# EAGLE design TIVA_SHIELD_Ver_2.2 (EAGLE 9.6.2)
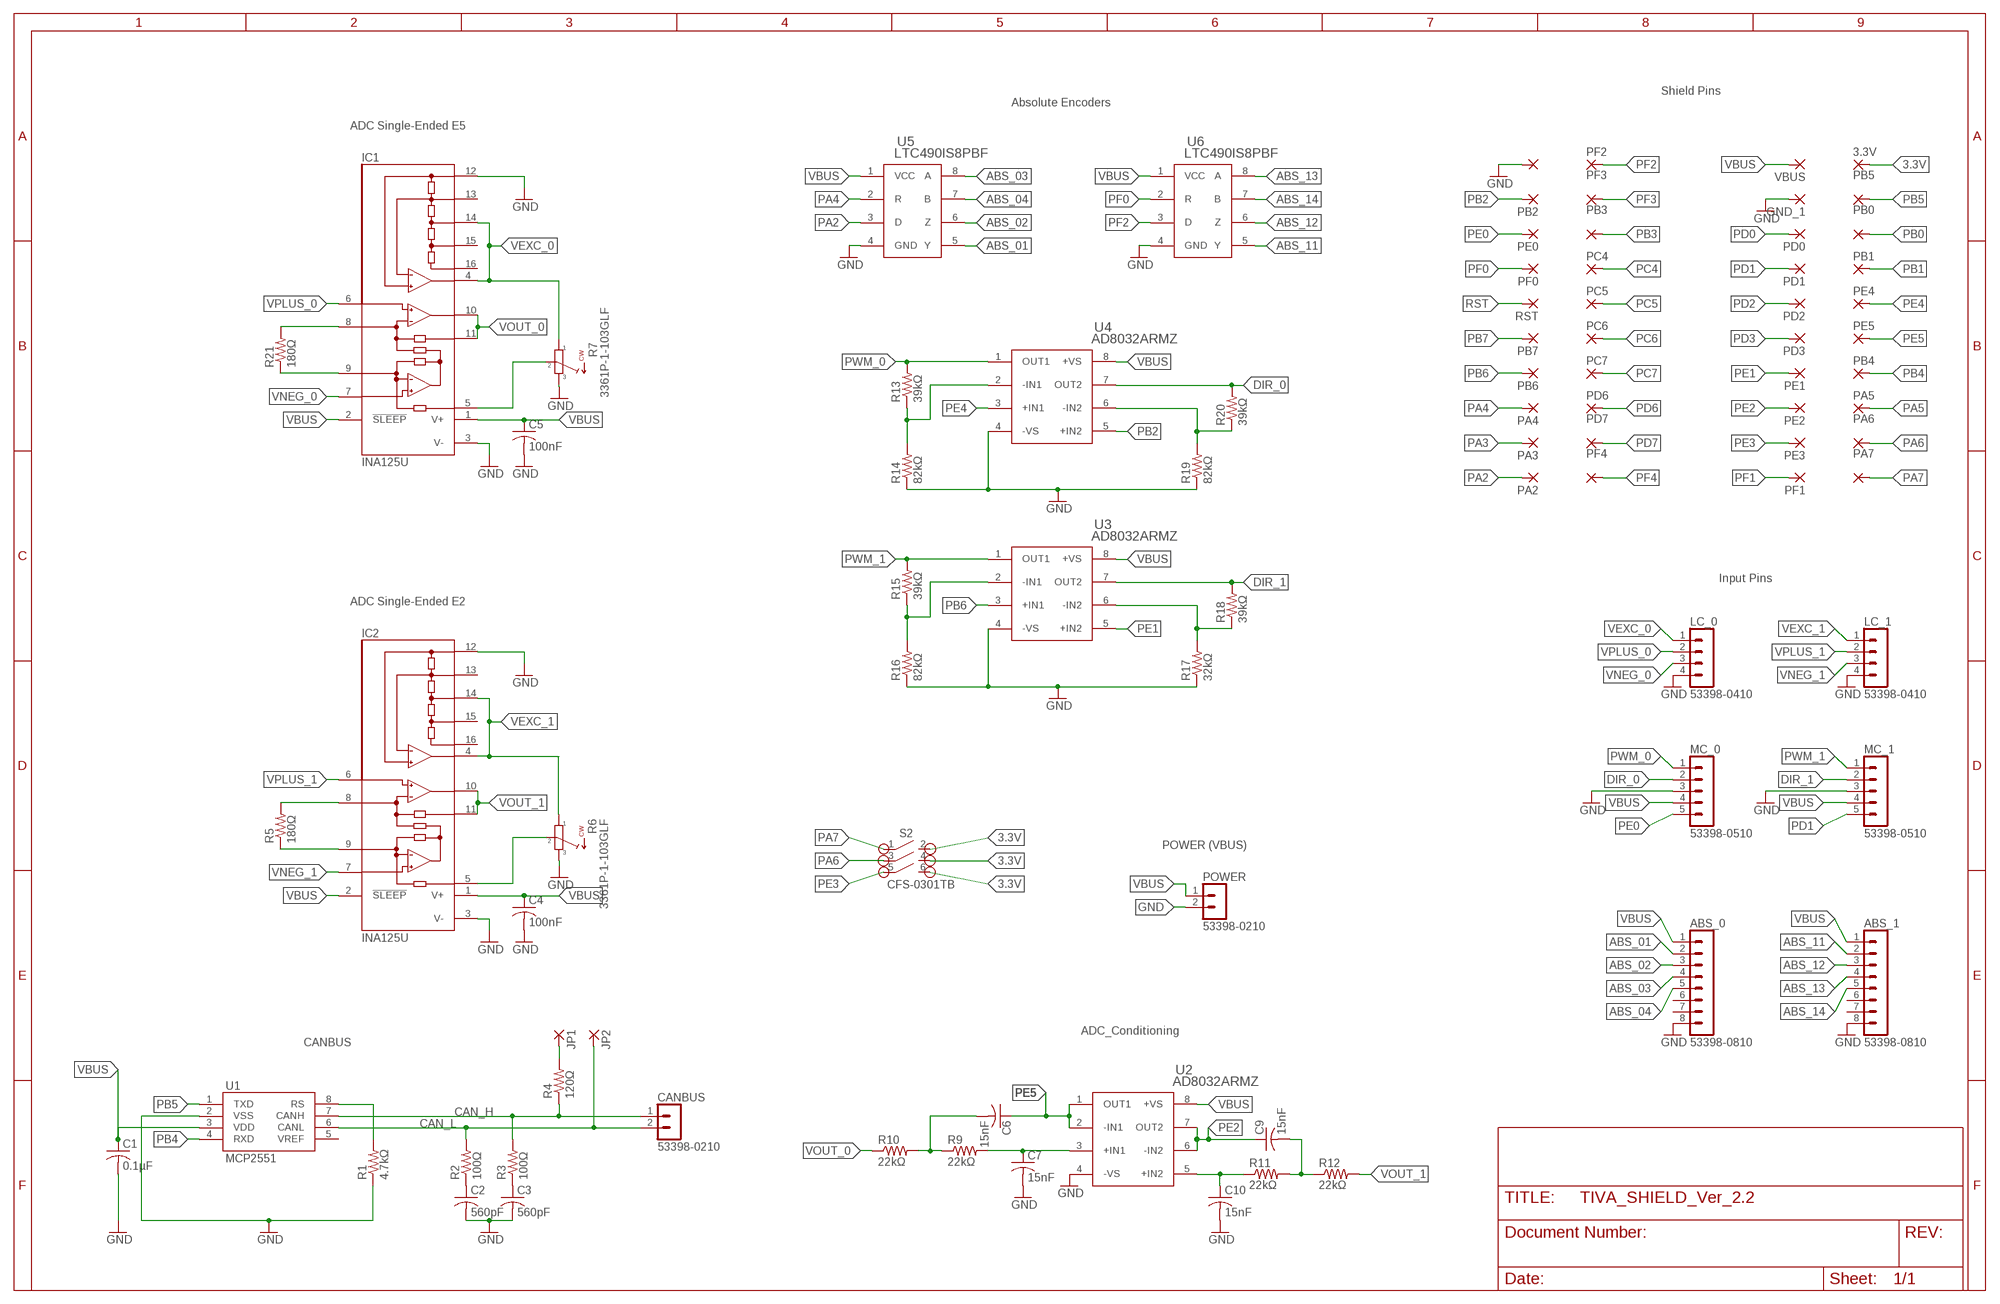
[diagram p0: schematic, sheet 1]

## Parts
3.3V  1,6/0,9  [1,6/0,9]
ABS_0  53398-0810  [53398-0810]
ABS_1  53398-0810  [53398-0810]
C1  0.1µF  C-USC0805  [C0805]
C2  560pF  C-USC0805  [C0805]
C3  560pF  C-USC0805  [C0805]
C4  100nF  C-USC0805  [C0805]
C5  100nF  C-USC0805  [C0805]
C6  15nF  C-USC0805  [C0805]
C7  15nF  C-USC0805  [C0805]
C9  15nF  C-USC0805  [C0805]
C10  15nF  C-USC0805  [C0805]
CANBUS  53398-0210  [53398-0210]
GND_0  1,6/0,9  [1,6/0,9]
GND_1  1,6/0,9  [1,6/0,9]
IC1  INA125U  [SO16-1]
IC2  INA125U  [SO16-1]
JP1  1,6/0,9  [1,6/0,9]
JP2  1,6/0,9  [1,6/0,9]
LC_0  53398-0410  [53398-0410]
LC_1  53398-0410  [53398-0410]
MC_0  53398-0510  [53398-0510]
MC_1  53398-0510  [53398-0510]
PA2  1,6/0,9  [1,6/0,9]
PA3  1,6/0,9  [1,6/0,9]
PA4  1,6/0,9  [1,6/0,9]
PA5  1,6/0,9  [1,6/0,9]
PA6  1,6/0,9  [1,6/0,9]
PA7  1,6/0,9  [1,6/0,9]
PB0  1,6/0,9  [1,6/0,9]
PB1  1,6/0,9  [1,6/0,9]
PB2  1,6/0,9  [1,6/0,9]
PB3  1,6/0,9  [1,6/0,9]
PB4  1,6/0,9  [1,6/0,9]
PB5  1,6/0,9  [1,6/0,9]
PB6  1,6/0,9  [1,6/0,9]
PB7  1,6/0,9  [1,6/0,9]
PC4  1,6/0,9  [1,6/0,9]
PC5  1,6/0,9  [1,6/0,9]
PC6  1,6/0,9  [1,6/0,9]
PC7  1,6/0,9  [1,6/0,9]
PD0  1,6/0,9  [1,6/0,9]
PD1  1,6/0,9  [1,6/0,9]
PD2  1,6/0,9  [1,6/0,9]
PD3  1,6/0,9  [1,6/0,9]
PD6  1,6/0,9  [1,6/0,9]
PD7  1,6/0,9  [1,6/0,9]
PE0  1,6/0,9  [1,6/0,9]
PE1  1,6/0,9  [1,6/0,9]
PE2  1,6/0,9  [1,6/0,9]
PE3  1,6/0,9  [1,6/0,9]
PE4  1,6/0,9  [1,6/0,9]
PE5  1,6/0,9  [1,6/0,9]
PF0  1,6/0,9  [1,6/0,9]
PF1  1,6/0,9  [1,6/0,9]
PF2  1,6/0,9  [1,6/0,9]
PF3  1,6/0,9  [1,6/0,9]
PF4  1,6/0,9  [1,6/0,9]
POWER  53398-0210  [53398-0210]
R1  4.7kΩ  R-US_R0805  [R0805]
R2  100Ω  R-US_R0805  [R0805]
R3  100Ω  R-US_R0805  [R0805]
R4  120Ω  R-US_R0805  [R0805]
R5  180Ω  R-US_R0805  [R0805]
R6  3361P-1-103GLF  3361P-1-103GLFSMD  [3361P-1-103GLF]
R7  3361P-1-103GLF  3361P-1-103GLFSMD  [3361P-1-103GLF]
R9  22kΩ  R-US_R0805  [R0805]
R10  22kΩ  R-US_R0805  [R0805]
R11  22kΩ  R-US_R0805  [R0805]
R12  22kΩ  R-US_R0805  [R0805]
R13  39kΩ  R-US_R0805  [R0805]
R14  82kΩ  R-US_R0805  [R0805]
R15  39kΩ  R-US_R0805  [R0805]
R16  82kΩ  R-US_R0805  [R0805]
R17  32kΩ  R-US_R0805  [R0805]
R18  39kΩ  R-US_R0805  [R0805]
R19  82kΩ  R-US_R0805  [R0805]
R20  39kΩ  R-US_R0805  [R0805]
R21  180Ω  R-US_R0805  [R0805]
RST  1,6/0,9  [1,6/0,9]
S2  CFS-0301TB  CFS-0301TBSMD  [CFS-0301TB]
U1  MCP2551  [SO08]
U2  AD8032ARMZ  [RM_8]
U3  AD8032ARMZ  [RM_8]
U4  AD8032ARMZ  [RM_8]
U5  LTC490IS8PBF  [SO-8_S]
U6  LTC490IS8PBF  [SO-8_S]
VBUS  1,6/0,9  [1,6/0,9]

## Nets
3.3V: 3.3V.1(P) S2.2 S2.4 S2.6
ABS_01: ABS_0.2 U5.5(Y)
ABS_02: ABS_0.3 U5.6(Z)
ABS_03: ABS_0.4 U5.8(A)
ABS_04: ABS_0.5 U5.7(B)
ABS_11: ABS_1.2 U6.5(Y)
ABS_12: ABS_1.3 U6.6(Z)
ABS_13: ABS_1.4 U6.8(A)
ABS_14: ABS_1.5 U6.7(B)
CAN_H: CANBUS.1 R3.2 R4.1 U1.7(CANH)
CAN_L: CANBUS.2 JP2.1(P) R2.2 U1.6(CANL)
DIR_0: MC_0.2 R20.2 U4.7(OUT2)
DIR_1: MC_1.2 R18.2 U3.7(OUT2)
GND: ABS_0.8 ABS_1.8 C1.2 C2.2 C3.2 C4.2 C5.2 C7.2 C10.2 GND_0.1(P) GND_1.1(P) IC1.3(V-) IC1.12(REFCOM) IC2.3(V-) IC2.12(REFCOM) LC_0.4 LC_1.4 MC_0.3 MC_1.3 POWER.2 R1.1 R6.3 R7.3 R14.1 R16.1 R17.1 R19.1 U1.2(VSS) U2.4(-VS) U3.4(-VS) U4.4(-VS) U5.4(GND) U6.4(GND)
N$1: R1.2 U1.8(RS)
N$4: C2.1 R2.1
N$5: C3.1 R3.1
N$6: JP1.1(P) R4.2
N$7: IC2.9(RG) R5.1
N$8: IC2.8(RG) R5.2
N$9: IC2.5(REF) R6.2
N$10: IC1.9(RG) R21.1
N$11: IC1.8(RG) R21.2
N$12: IC1.5(REF) R7.2
N$13: C10.1 R11.1 U2.5(+IN2)
N$14: C9.2 R11.2 R12.1
N$15: C7.1 R9.2 U2.3(+IN1)
N$16: R19.2 R20.1 U4.6(-IN2)
N$17: R17.2 R18.1 U3.6(-IN2)
N$18: C6.2 R9.1 R10.2
N$19: R13.1 R14.2 U4.2(-IN1)
N$20: R15.1 R16.2 U3.2(-IN1)
PA2: PA2.1(P) U5.3(D)
PA3: PA3.1(P)
PA4: PA4.1(P) U5.2(R)
PA5: PA5.1(P)
PA6: PA6.1(P) S2.3
PA7: PA7.1(P) S2.1
PB0: PB0.1(P)
PB1: PB1.1(P)
PB2: PB2.1(P) U4.5(+IN2)
PB3: PB3.1(P)
PB4: PB4.1(P) U1.4(RXD)
PB5: PB5.1(P) U1.1(TXD)
PB6: PB6.1(P) U3.3(+IN1)
PB7: PB7.1(P)
PC4: PC4.1(P)
PC5: PC5.1(P)
PC6: PC6.1(P)
PC7: PC7.1(P)
PD0: PD0.1(P)
PD1: MC_1.5 PD1.1(P)
PD2: PD2.1(P)
PD3: PD3.1(P)
PD6: PD6.1(P)
PD7: PD7.1(P)
PE0: MC_0.5 PE0.1(P)
PE1: PE1.1(P) U3.5(+IN2)
PE2: C9.1 PE2.1(P) U2.6(-IN2) U2.7(OUT2)
PE3: PE3.1(P) S2.5
PE4: PE4.1(P) U4.3(+IN1)
PE5: C6.1 PE5.1(P) U2.1(OUT1) U2.2(-IN1)
PF0: PF0.1(P) U6.2(R)
PF1: PF1.1(P)
PF2: PF2.1(P) U6.3(D)
PF3: PF3.1(P)
PF4: PF4.1(P)
PWM_0: MC_0.1 R13.2 U4.1(OUT1)
PWM_1: MC_1.1 R15.2 U3.1(OUT1)
RST: RST.1(P)
VBUS: ABS_0.1 ABS_1.1 C1.1 C4.1 C5.1 IC1.1(V+) IC1.2(!SLEEP) IC2.1(V+) IC2.2(!SLEEP) MC_0.4 MC_1.4 POWER.1 U1.3(VDD) U2.8(+VS) U3.8(+VS) U4.8(+VS) U5.1(VCC) U6.1(VCC) VBUS.1(P)
VEXC_0: IC1.4(REFOUT) IC1.14(REF2.5) LC_0.1 R7.1
VEXC_1: IC2.4(REFOUT) IC2.14(REF2.5) LC_1.1 R6.1
VNEG_0: IC1.7(-IN) LC_0.3
VNEG_1: IC2.7(-IN) LC_1.3
VOUT_0: IC1.10(OUT) IC1.11(SENSE) R10.1
VOUT_1: IC2.10(OUT) IC2.11(SENSE) R12.2
VPLUS_0: IC1.6(+IN) LC_0.2
VPLUS_1: IC2.6(+IN) LC_1.2
Unconnected: ABS_0.6 ABS_0.7 ABS_1.6 ABS_1.7 IC1.13(REFBG) IC1.15(REF5) IC1.16(REF10) IC2.13(REFBG) IC2.15(REF5) IC2.16(REF10) U1.5(VREF)

## Notes on the sheet
- Shield Pins
- Absolute Encoders
- ADC Single-Ended E5
- Input Pins
- ADC Single-Ended E2
- POWER (VBUS)
- ADC_Conditioning
- CANBUS

## Library data of the parts
3.3V GND_0 GND_1 JP1 JP2 PA2-PA7 PB0 PB1-PB7 PC4-PC7 PD0 PD1-PD3 PD6 PD7 PE0 PE1-PE5 PF0 PF1-PF4 RST VBUS = wirepad:1,6/0,9: THROUGH-HOLE PAD
ABS_0 ABS_1 = con-molex-picoblade:53398-0810: HEADER
C1-C7 C9 C10 = rcl:C-US: CAPACITOR, American symbol; SPICEPREFIX: C
CANBUS POWER = con-molex-picoblade:53398-0210: HEADER
IC1 IC2 = burr-brown_1:INA125: Instrumentation Amplifier with Precision Voltage Reference; MF: TEXAS INSTRUMENT CONNECTORS; MPN: INA125U; OC_FARNELL: 1304375; OC_NEWARK: 80K5901
LC_0 LC_1 = con-molex-picoblade:53398-0410: HEADER
MC_0 MC_1 = con-molex-picoblade:53398-0510: HEADER
R1-R5 R9-R21 = rcl:R-US_: RESISTOR, American symbol; SPICEPREFIX: R
R6 R7 = TREC_Library:3361P-1-103GLF: Bourns Surface Mount Trimmer Potentiometer
S2 = TREC_Library:CFS-0301TB: CFS Slide Switches 3 Position Slide Switch CFS-0301TB CFS = Series Name 03 = Number of bits 01 = Flat Knob non washable type T = Packing = Taping B = Gull Wing CFS DATASHEET <https://www.nidec-copal-electronics.com/e/catalog/switch/cfs.pdf>
U1 = SparkFun-IC-Comms:MCP2551: MCP2551 High Speed CAN Transceiver High speed CAN transceiver Datasheet <http://www.sparkfun.com/datasheets/DevTools/Arduino/MCP2551.pdf> SparkFun Products CAN-BUS Shield <https://www.sparkfun.com/products/13262> (DEV-13262) SparkFun OBD-II UART <https://www.sparkfun.com/products/9555> (WIG-09555); PROD_ID: IC-09907
U2-U4 = AD8032ARMZ:AD8032ARMZ; MANUFACTURER_PART_NUMBER: AD8032ARMZ; VENDOR: Analog Devices Inc
U5 U6 = LTC490:LTC490IS8PBF; MANUFACTURER_PART_NUMBER: LTC490IS8#PBF; VENDOR: Linear Technology

## Board
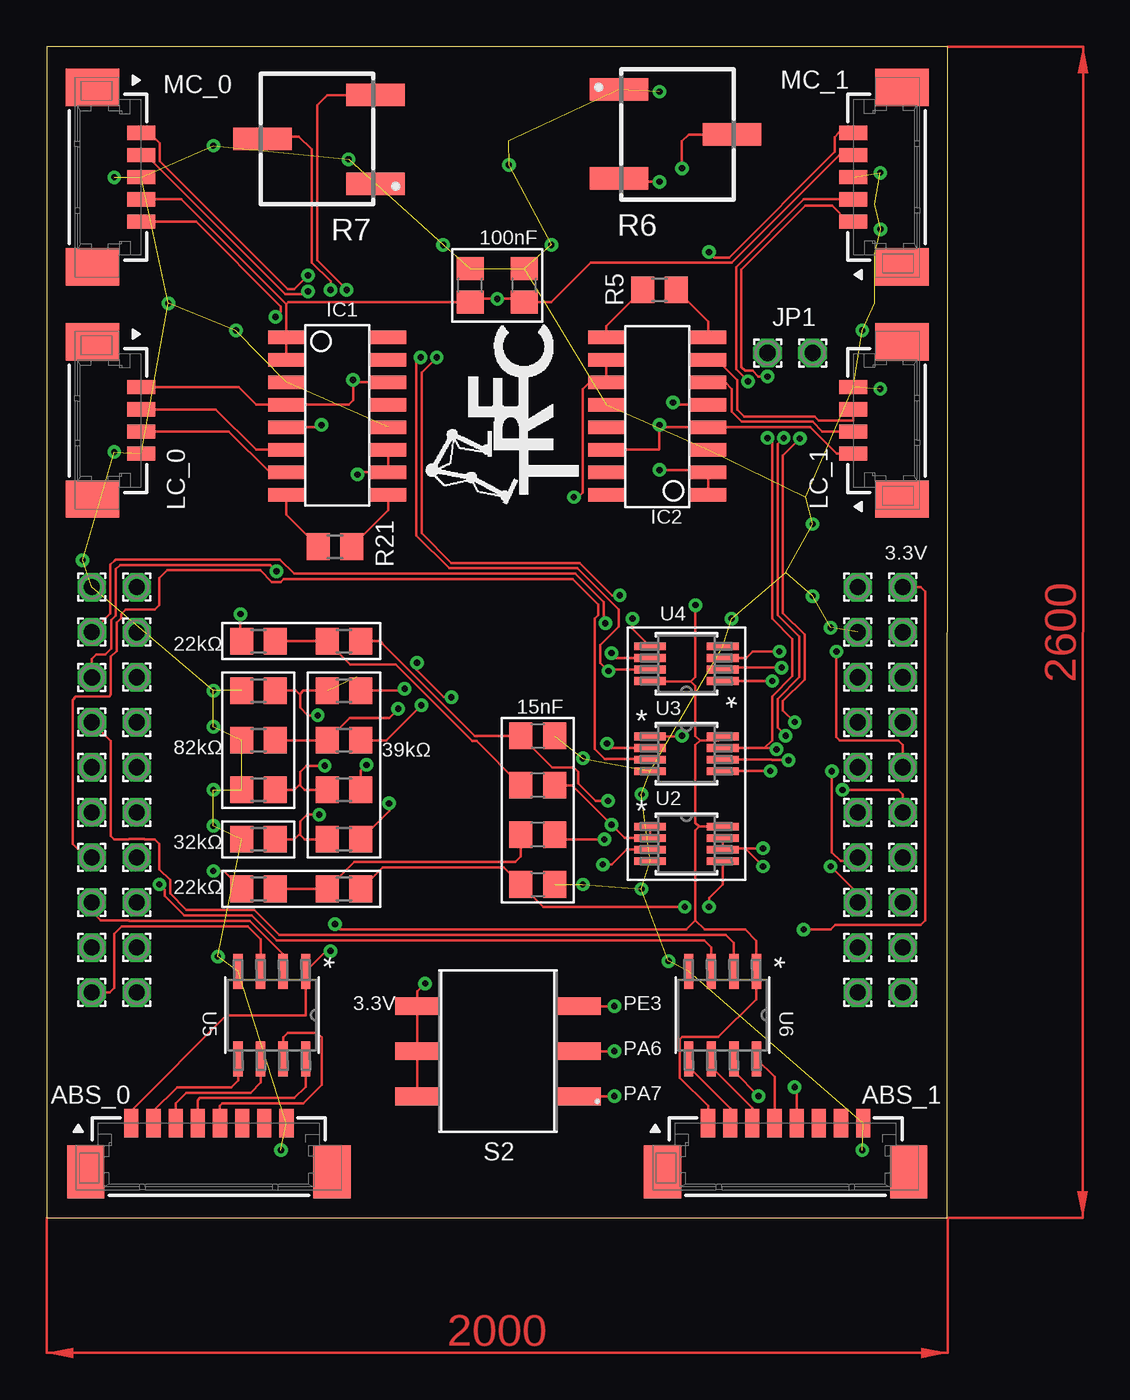
[diagram p1: board, top side]
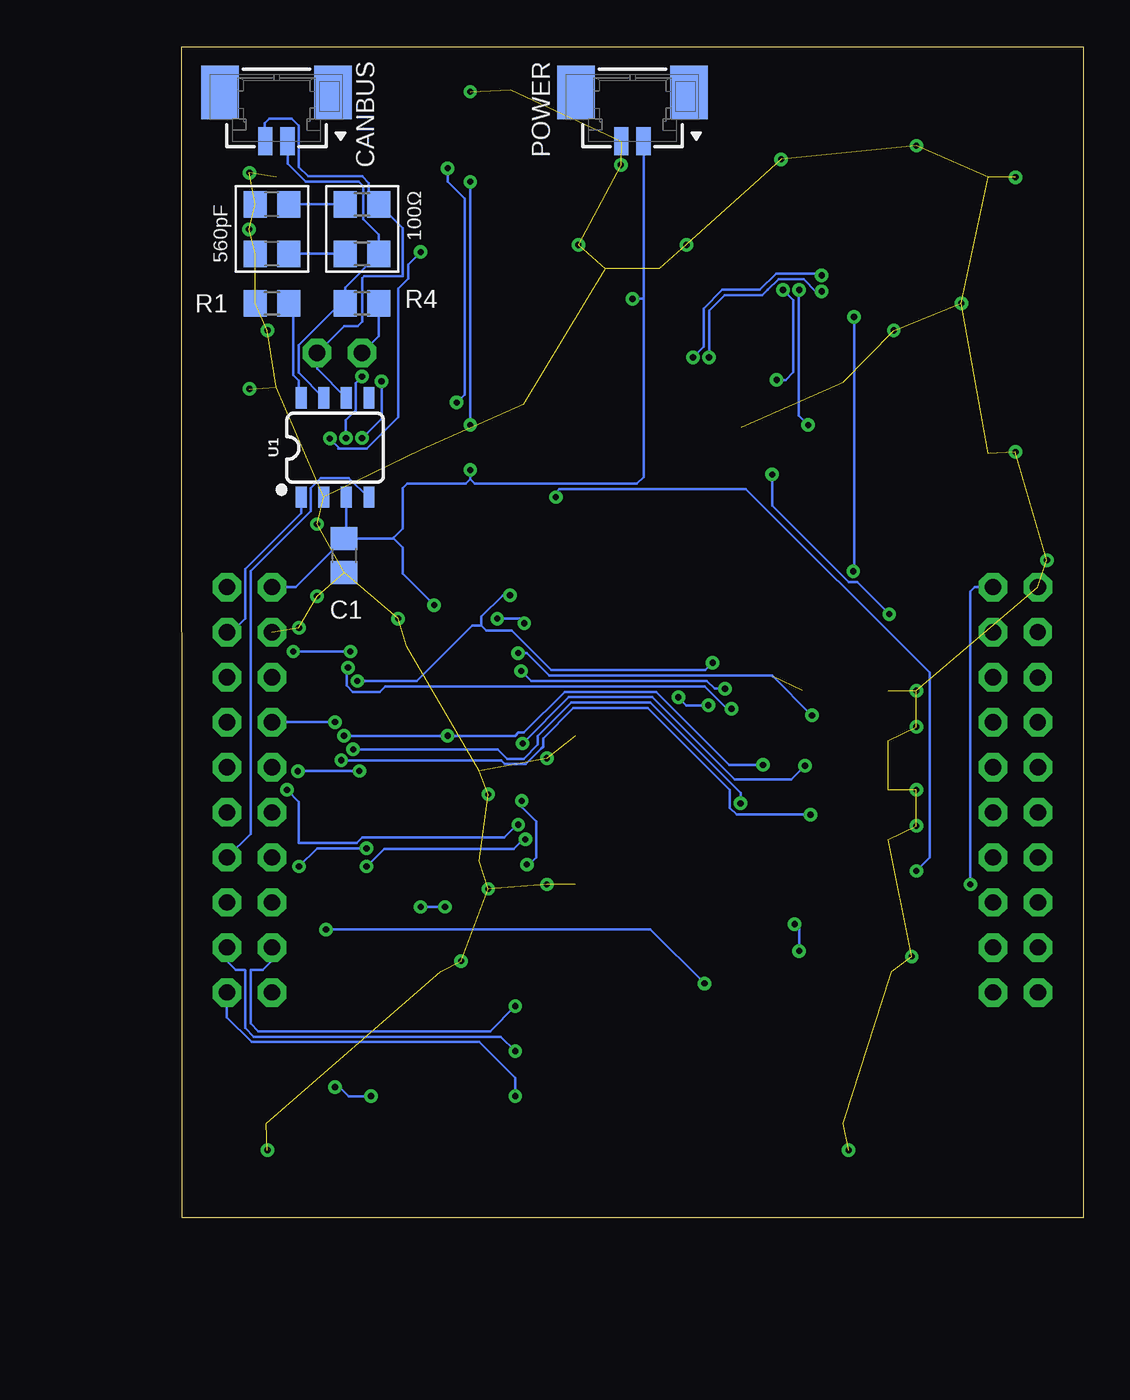
[diagram p2: board, bottom side, seen from below]

Size 50.81 x 66.04 mm. Coordinates in mm from the lower left corner, seen from the top.
Outline: 0,0 50.78,0 50.8,66.04 0,66.04 0,0
Copper layers (1*16): Top 0.035mm / dielectric 1.5mm / Bottom 0.035mm
Design rules "default": minimum track width 6mil, minimum drill 0.35mm, track to track 6mil, track to pad 6mil, pad to pad 6mil, via to via 6mil, smd to smd 6mil, copper to edge 40mil, drill to drill 6mil, minimum pad ring 10mil, minimum via ring 8mil, stop-mask expansion 4mil, vias tented up to drill 0mil, thermal gap 10mil

### Footprints (pad centres in the part's own frame; a part is rotated, then mirrored left to right if it is on the bottom)
1,6/0,9 = drill 0.914 pad 1.6 octagon: 1 0,0
53398-0810 = smd 0.8 x 1.6: 1 4.375,0; 2 3.125,0; 3 1.875,0; 4 0.625,0; 5 -0.625,0; 6 -1.875,0; 7 -3.125,0; 8 -4.375,0 | smd 2.1 x 3: M1 6.935,2.75; M2 -6.935,2.75
C0805 = smd 1.3 x 1.5: 1 -0.95,0; 2 0.95,0
53398-0210 = smd 0.8 x 1.6: 1 0.625,0; 2 -0.625,0 | smd 2.1 x 3: M1 3.185,2.75; M2 -3.185,2.75
SO16-1 = smd 0.762 x 2.032: 1 -4.445,-4.775; 2 -3.175,-4.775; 3 -1.905,-4.775; 4 -0.635,-4.775; 5 0.635,-4.775; 6 1.905,-4.775; 7 3.175,-4.775; 8 4.445,-4.775; 9 4.445,0.965; 10 3.175,0.965; 11 1.905,0.965; 12 0.635,0.965; 13 -0.635,0.965; 14 -1.905,0.965; 15 -3.175,0.965; 16 -4.445,0.965
53398-0410 = smd 0.8 x 1.6: 1 1.875,0; 2 0.625,0; 3 -0.625,0; 4 -1.875,0 | smd 2.1 x 3: M1 4.435,2.75; M2 -4.435,2.75
53398-0510 = smd 0.8 x 1.6: 1 2.5,0; 2 1.25,0; 3 0,0; 4 -1.25,0; 5 -2.5,0 | smd 2.1 x 3: M1 5.06,2.75; M2 -5.06,2.75
R0805 = smd 1.3 x 1.5: 1 -0.95,0; 2 0.95,0
3361P-1-103GLF = smd 1.27 x 3.302: 1 2.353,-3.294; 2 -0.116,3.076; 3 -2.66,-3.301
CFS-0301TB = smd 1 x 2.5: 1 0.5,1.25; 2 0.5,10.35; 3 3.04,1.25; 4 3.04,10.35; 5 5.58,1.25; 6 5.58,10.35
SO08 = smd 0.6 x 1.2: 1 -1.905,-2.8; 2 -0.635,-2.8; 3 0.635,-2.8; 4 1.905,-2.8; 5 1.905,2.8; 6 0.635,2.8; 7 -0.635,2.8; 8 -1.905,2.8
RM_8 = smd 1.778 x 0.432: 1 -2.045,0.975; 2 -2.045,0.325; 3 -2.045,-0.325; 4 -2.045,-0.975; 5 2.045,-0.975; 6 2.045,-0.325; 7 2.045,0.325; 8 2.045,0.975
SO-8_S = smd 1.981 x 0.533: 1 -2.464,1.905; 2 -2.464,0.635; 3 -2.464,-0.635; 4 -2.464,-1.905; 5 2.464,-1.905; 6 2.464,-0.635; 7 2.464,0.635; 8 2.464,1.905

### Placement (x,y rotation side)
3.3V  48.26,35.56 0 top
ABS_0  9.14,5.33 180 top
ABS_1  41.66,5.33 180 top
C1  41.66,37.34 270 bottom
C2  45.72,57.15 180 bottom
C3  45.72,54.36 180 bottom
C4  26.92,52.58 90 top
C5  23.88,52.58 90 top
C6  27.69,24.38 180 top
C7  27.69,27.18 0 top
C9  27.69,21.59 180 top
C10  27.69,18.8 0 top
CANBUS  45.47,60.71 0 bottom
GND_0  2.54,35.56 0 top
GND_1  45.72,33.02 0 top
IC1  18.29,45.21 270 top
IC2  32.51,45.21 90 top
JP1  40.64,48.77 90 top
JP2  43.18,48.77 90 top
LC_0  5.33,44.96 90 top
LC_1  45.47,44.96 270 top
MC_0  5.33,58.67 90 top
MC_1  45.47,58.67 270 top
PA2  2.54,12.7 0 top
PA3  2.54,15.24 0 top
PA4  2.54,17.78 0 top
PA5  48.26,17.78 0 top
PA6  48.26,15.24 0 top
PA7  48.26,12.7 0 top
PB0  48.26,30.48 0 top
PB1  48.26,27.94 0 top
PB2  2.55,33.03 0 top
PB3  5.08,30.48 0 top
PB4  48.26,20.32 0 top
PB5  48.26,33.02 0 top
PB6  2.54,20.32 0 top
PB7  2.54,22.86 0 top
PC4  5.08,27.94 0 top
PC5  5.08,25.4 0 top
PC6  5.08,22.86 0 top
PC7  5.08,20.32 0 top
PD0  45.72,30.48 0 top
PD1  45.72,27.94 0 top
PD2  45.72,25.4 0 top
PD3  45.72,22.86 0 top
PD6  5.08,17.78 0 top
PD7  5.08,15.24 0 top
PE0  2.55,30.47 0 top
PE1  45.72,20.32 0 top
PE2  45.72,17.78 0 top
PE3  45.72,15.24 0 top
PE4  48.26,25.4 0 top
PE5  48.26,22.86 0 top
PF0  2.55,27.95 0 top
PF1  45.72,12.7 0 top
PF2  5.08,35.56 0 top
PF3  5.08,33.02 0 top
PF4  5.08,12.7 0 top
POWER  25.4,60.71 0 bottom
R1  45.72,51.56 0 bottom
R2  40.64,57.15 0 bottom
R3  40.64,54.36 0 bottom
R4  40.64,51.56 0 bottom
R5  34.54,52.32 0 top
R6  35.56,60.96 270 top
R7  15.24,60.96 90 top
R9  16.76,32.51 0 top
R10  11.94,32.51 0 top
R11  16.76,18.54 180 top
R12  11.94,18.54 180 top
R13  16.76,26.92 0 top
R14  11.94,26.92 0 top
R15  16.76,24.13 0 top
R16  11.94,24.13 0 top
R17  11.94,21.34 0 top
R18  16.76,21.34 0 top
R19  11.94,29.72 0 top
R20  16.76,29.72 0 top
R21  16.26,37.85 180 top
RST  2.54,25.4 0 top
S2  31.24,6.35 90 top
U1  42.16,43.43 0 bottom
U2  36.07,21.08 0 top
U3  36.07,26.16 0 top
U4  36.07,31.24 180 top
U5  12.7,11.43 270 top
U6  38.1,11.43 270 top
VBUS  45.72,35.56 0 top

### Tracks (layer width: path | path; a pad name or v marks a point on that pad's centre or on a via)
3.3V  (via drill 0.35)
  Top 0.152: S2.2 S2.4 S2.6 20.89,12.76 v21.34,13.21 | v42.67,16.26 44.2,16.26 44.45,16.51 49.28,16.51 49.53,16.76 49.53,35.31 49.28,35.56 3.3V.1
  Bottom 0.152: v21.34,13.21 24.38,16.26 v42.67,16.26
ABS_01
  Top 0.152: ABS_0.2 6.02,6.02 7.36,7.36 10.41,7.36 10.8,7.74 U5.5
ABS_02
  Top 0.152: ABS_0.3 7.27,6.45 7.87,7.05 11.5,7.05 12.06,7.62 U5.6
ABS_03
  Top 0.152: ABS_0.4 8.52,6.63 8.64,6.75 13.97,6.75 14.61,7.38 U5.8
ABS_04
  Top 0.152: ABS_0.5 9.77,6.31 9.91,6.44 14.48,6.44 15.52,7.49 15.52,10.16 15.27,10.41 13.59,10.41 13.34,10.16 U5.7
ABS_11
  Top 0.152: ABS_1.2 38.53,6.17 36.2,8.51 U6.5
ABS_12
  Top 0.152: ABS_1.3 39.78,6.19 37.47,8.51 U6.6
ABS_13
  Top 0.152: ABS_1.4 41.03,7.94 U6.8
ABS_14  (via drill 0.35)
  Top 0.152: U6.7 38.75,8.95 38.75,8.24 v40.13,6.86 | v42.16,7.37 42.28,7.25 ABS_1.5
  Bottom 0.152: v40.13,6.86 41.4,6.86 41.91,7.37 v42.16,7.37
CAN_H
  Bottom 0.152: U1.7 44.21,47.64 44.21,49.19 41.84,51.56 R4.1 41.59,52.46 R3.2 39.69,55.43 40.57,56.3 40.57,58.17 40.82,58.42 43.81,58.42 44.84,59.45 CANBUS.1
CAN_L
  Bottom 0.152: CANBUS.2 46.12,60.73 46.12,61.72 45.86,61.98 44.59,61.98 44.2,61.58 44.2,59.23 43.69,58.73 40.64,58.73 40.26,58.35 40.26,57.72 R2.2 38.35,55.81 38.35,53.09 40.53,53.09 40.64,52.98 40.64,50.55 40.89,50.29 41.66,50.29 JP2.1 43.18,47.88 U1.6
DIR_0  (via drill 0.35)
  Top 0.152: 5.35,59.94 MC_0.2 5.61,59.92 13.46,52.07 14.57,52.07 v14.73,52.23 | U4.7 32.24,30.92 31.76,30.92 v31.67,30.83 v31.66,30.82 | v21.08,48.51 20.83,48.26 20.83,38.48 22.68,36.63 29.92,36.63 32.24,34.31 32.24,33.35 31.2,32.31 31.2,31.29 v31.66,30.82 | R20.2 20.07,29.72 v20.18,29.84 | 31.66,30.82 v31.66,30.82
  Bottom 0.152: v21.08,48.51 21.08,51.15 20.21,52.02 18.09,52.02 17.78,52.32 17.77,52.32 17.16,52.93 15.75,52.93 15.05,52.23 v14.73,52.23 | v20.18,29.84 20.77,29.84 21.2,30.27 31.11,30.27 v31.67,30.83
DIR_1  (via drill 0.35)
  Top 0.152: U3.7 40.46,26.49 | 40.46,26.49 40.89,26.92 40.89,29.4 42.04,30.55 42.04,32.63 40.89,33.78 40.89,43.72 v40.64,43.97 | v39.54,47.17 38.86,47.84 38.86,53.59 42.69,57.42 MC_1.2 | R18.2 19.3,22.93 v19.3,23.37 | v41.14,26.41 41.06,26.49 40.46,26.49
  Bottom 0.152: v40.64,43.97 39.54,45.07 v39.54,47.17 | v19.3,23.37 19.3,23.95 24.4,29.05 28.85,29.05 30.74,27.16 30.74,26.68 31.54,25.88 32.46,25.88 32.99,26.41 v41.14,26.41
GND  (via drill 0.35)  (63 unrouted)
  other vias: 45.97,3.81 9.65,14.73 13.21,3.81 9.4,22.1 9.4,24.13 9.4,27.69 9.4,29.72 2.03,37.08 38.61,33.78 43.18,35.05 44.2,33.27 28.45,54.86 22.35,54.86 26.05,59.37 17.02,59.69 34.54,63.5 46.99,58.93 46.99,46.74 3.81,58.67 9.4,60.45 6.86,51.56 10.67,50.04 3.81,43.18 33.53,23.88 33.53,18.54 35.05,14.48 30.23,25.91 30.23,18.8 47.01,55.74 45.97,50.04 43.18,39.12
N$1
  Bottom 0.152: U1.8 44.2,46.36 44.2,47.2 44.51,47.52 44.51,51.31 R1.2
N$4
  Bottom 0.152: C2.1 R2.1
N$5
  Bottom 0.152: R3.1 C3.1
N$6
  Bottom 0.152: JP1.1 39.69,49.72 R4.2
N$7
  Top 0.152: R5.1 31.55,50.28 IC2.9
N$8
  Top 0.152: R5.2 37.29,50.53 IC2.8
N$9  (via drill 0.35)
  Top 0.152: IC2.5 35.43,45.85 v35.31,45.97 | v35.81,59.18 35.81,60.71 36.18,61.08 R6.2
  Bottom 0.152: v35.31,45.97 34.85,46.43 34.85,57.45 35.81,58.42 v35.81,59.18
N$10
  Top 0.152: R21.1 19.25,39.89 IC1.9
N$11
  Top 0.152: R21.2 13.51,39.64 IC1.8
N$12  (via drill 0.35)
  Top 0.152: IC1.5 15.37,44.58 v15.49,44.7 | v16,52.32 16,52.8 14.94,53.87 14.94,60.25 14.22,60.96 12.28,60.96 R7.2
  Bottom 0.152: v15.49,44.7 16.03,45.24 16.03,52.3 v16,52.32
N$13  (via drill 0.35)
  Top 0.152: R11.1 18.93,19.76 25.77,19.76 C10.1 28.01,17.53 v35.97,17.53 | v37.34,17.53 37.34,18.03 38.11,18.81 U2.5
  Bottom 0.152: v35.97,17.53 v37.34,17.53
N$14
  Top 0.152: R12.1 R11.2 17.34,20.07 26.42,20.07 26.74,20.39 C9.2
N$15  (via drill 0.35)
  Top 0.152: v31.64,23.51 30.96,23.51 29.97,24.5 29.97,25.15 29.72,25.4 28.51,25.4 C7.1 24.13,27.18 18.92,32.38 18.92,32.39 18.8,32.51 R9.2 | v31.35,19.92 31.86,19.92 32.7,20.76 U2.3
  Bottom 0.152: v31.64,23.51 31.64,23.16 30.83,22.35 30.83,20.32 31.23,19.92 v31.35,19.92
N$16  (via drill 0.35)  (1 unrouted)
  Top 0.152: U4.6 32.11,31.57 v31.84,31.84 | R20.1 14.48,29.72 14.28,29.52 14.28,29.46 | R19.2 14.03,29.72 14.28,29.46 | v15.28,28.33 14.73,28.33 14.28,28.78 14.28,29.46
  Bottom 0.152: v15.28,28.33 17.53,30.57 | 17.48,30.52 17.53,30.57 | v31.84,31.84 31.36,31.84 30.1,30.57 17.53,30.57
N$17  (via drill 0.35)
  Top 0.152: R18.1 14.56,21.34 14.31,21.59 14.31,21.67 | R17.2 13.97,21.34 14.31,21.67 | U3.6 40.85,25.84 40.89,25.8 v41.81,25.8 v41.82,25.8 | 14.31,21.67 14.31,22.35 14.68,22.73 v15.37,22.73
  Bottom 0.152: v41.82,25.8 32.81,25.8 32.59,25.58 31.41,25.58 30.53,26.46 | v15.37,22.73 19.52,22.73 19.91,23.12 19.91,24.13 24.53,28.74 28.73,28.74 30.44,27.03 30.44,26.55 30.53,26.46 | 30.48,26.52 30.53,26.46 | 30.53,26.46
N$18
  Top 0.152: R10.2 R9.1 17.12,31.2 19.67,31.2 24,26.87 | C6.2 24.25,26.87 24,26.87 | 24,26.87
N$19  (via drill 0.35)
  Top 0.152: U4.2 38.22,31.02 v41.44,31.02 | R14.2 R13.1 17.08,28.19 19.3,28.19 v19.81,28.7
  Bottom 0.152: v19.81,28.7 20.07,28.7 21.33,29.96 39.34,29.96 39.64,29.66 41.16,29.66 41.51,30.02 41.51,30.88 41.44,30.96 v41.44,31.02
N$20  (via drill 0.35)
  Top 0.152: R15.1 14.56,24.13 14.31,24.38 14.31,24.47 | R16.2 13.97,24.13 14.31,24.47 | 15.68,25.45 v15.68,25.49 14.64,25.49 14.31,25.15 14.31,24.47 | v31.59,26.74 31.84,26.49 U3.2
  Bottom 0.152: v15.68,25.49 16.44,24.72 19.64,24.72 24.27,29.35 28.98,29.35 v31.59,26.74
PA2
  Top 0.152: U5.3 12.06,15.7 11.34,16.43 4.24,16.43 3.81,16 3.81,12.95 3.56,12.7 PA2.1
PA4
  Top 0.152: U5.2 13.34,14.86 11.44,16.75 4.65,16.75 4.64,16.76 3.05,16.76 2.54,17.27 PA4.1
PA6  (via drill 0.35)
  Top 0.152: S2.3 v32,9.39 v32,9.4
  Bottom 0.152: PA6.1 48.26,14.48 47.75,13.97 47.24,13.97 47.23,13.96 47.23,10.71 46.74,10.21 32.82,10.21 v32,9.4
PA7  (via drill 0.35)
  Top 0.152: S2.1 v32,6.85 v32,6.86
  Bottom 0.152: PA7.1 48.26,11.3 46.86,9.91 34.04,9.91 32,7.87 v32,6.86
PB2  (via drill 0.35)
  Top 0.152: U4.5 33.02,33.22 v33.02,33.78 | PB2.1 3.59,34.07 3.59,36.83 3.83,37.06 3.88,37.12 13.15,37.12 13.95,36.32 29.8,36.32 31.41,34.71 31.41,33.62 v31.5,33.53
  Bottom 0.152: v33.02,33.78 31.75,33.78 v31.5,33.53
PB4
  Bottom 0.152: U1.4 40.31,40.63 41.39,41.72 42.97,41.72 43.54,41.15 43.54,39.85 46.92,36.46 46.92,21.66 PB4.1
PB5
  Bottom 0.152: U1.1 44.07,39.75 47.23,36.59 47.23,34.58 47.23,33.78 47.99,33.02 PB5.1
PB6
  Top 0.152: U3.3 33.98,25.88 31.45,25.88 30.89,26.44 30.89,33.78 31.1,33.99 31.1,34.58 29.67,36.02 13.37,36.02 13.21,35.85 12.7,35.85 12.04,36.51 6.79,36.51 6.35,36.07 6.35,34.54 6.1,34.29 4.46,34.29 4.2,34.04 4.2,33.82 3.95,33.57 3.95,31.97 3.62,31.64 3.62,29.49 3.52,29.39 1.64,29.39 1.46,29.21 1.46,21.08 2.22,20.32 PB6.1
PD1  (via drill 0.35)
  Top 0.152: MC_1.5 44.66,61.17 44.43,60.94 44.43,60.1 38.48,54.15 37.64,54.15 v37.34,54.45 | v42.46,43.94 41.5,42.99 41.5,34.11 42.72,32.89 42.72,30.35 41.5,29.14 41.5,28.62 v42.17,27.95
  Bottom 0.152: v37.34,54.45 38.05,53.74 38.05,52.96 38.61,52.4 38.61,45.14 40.39,43.36 41.91,43.36 | 41.91,43.36 41.98,43.36 | 41.91,43.36 42.46,43.91 v42.46,43.94 | v42.17,27.95 PD1.1
PE0  (via drill 0.35)
  Top 0.152: MC_0.5 8.42,56.17 13.21,51.38 13.21,51.1 v12.91,50.8 | v12.95,36.46 12.6,36.82 4.14,36.82 3.9,36.58 3.9,33.95 3.64,33.69 3.64,32.09 3.3,31.75 2.79,31.75 2.54,31.5 2.54,30.48 PE0.1
  Bottom 0.152: v12.91,50.8 12.91,36.51 v12.95,36.46
PE1  (via drill 0.35)
  Top 0.152: U3.5 v40.79,25.19 | v44.26,25.18 44.26,20.61 44.75,20.11 45.51,20.11 PE1.1
  Bottom 0.152: v40.79,25.19 44.25,25.19 v44.26,25.18
PE2  (via drill 0.35)
  Top 0.152: U2.7 U2.6 38.18,20.83 39.37,20.83 | 39.37,20.83 v40.39,20.83 | v40.39,19.81 39.37,20.83 | v31.43,21.34 28.89,21.34 C9.1 | PE2.1 45.72,18.29 v44.2,19.81
  Bottom 0.152: v40.39,20.83 43.18,20.83 v44.2,19.81 | v31.43,21.34 31.56,21.34 32.09,20.8 39.4,20.8 v40.39,19.81
PE3  (via drill 0.35)
  Top 0.152: S2.5 v32,11.93 v32,11.94
  Bottom 0.152: v32,11.94 33.43,10.52 46.48,10.52 46.93,10.96 46.93,13.97 46.23,13.97 45.72,14.48 PE3.1
PE4  (via drill 0.35)
  Top 0.152: U4.3 39.44,31.57 39.8,31.93 v41.3,31.93 | v44.52,31.93 44.52,27.11 44.72,26.91 48.02,26.91 48.26,26.67 PE4.1
  Bottom 0.152: v41.3,31.93 v44.52,31.93
PE5  (via drill 0.35)
  Top 0.152: U2.1 U2.2 32.6,21.41 v31.84,22.17 29.62,24.38 | PE5.1 48.26,23.88 48.01,24.13 v44.87,24.13 | C6.1 29.62,24.38 | 29.62,24.38 29.65,24.38
  Bottom 0.152: v31.84,22.17 31.86,22.2 32.63,21.43 40.64,21.43 40.94,21.13 44.2,21.13 44.2,23.46 v44.87,24.13
PF0
  Top 0.152: U6.2 38.73,15.49 38.28,15.95 13.11,15.95 11.7,17.36 7.87,17.36 6.96,18.28 6.96,19.05 6.35,19.65 6.35,21.08 6.1,21.34 5.52,21.34 5.51,21.35 4.65,21.35 4.64,21.34 3.81,21.34 3.62,21.53 3.62,26.87 PF0.1
PF2  (via drill 0.35)
  Top 0.152: U6.3 37.47,15.24 37.06,15.65 12.98,15.65 11.57,17.06 7.75,17.06 6.65,18.15 6.65,18.49 v6.35,18.8
  Bottom 0.152: v6.35,18.8 6.35,35.31 6.1,35.56 PF2.1
PWM_0  (via drill 0.35)
  Top 0.152: 5.36,61.15 MC_0.1 5.8,61.17 6.37,60.6 6.37,59.59 13.59,52.38 13.97,52.38 v14.73,53.14 | U4.1 v40.9,30.27 | 31.9,35.1 v32.31,35.1 31.88,35.1 30.05,36.93 22.81,36.93 21.13,38.61 21.13,47.66 v21.99,48.51 | R13.2 19.15,26.92 v21.12,28.9 | v22.81,29.36 22.38,29.36 20.83,30.91 20.83,31.24 v20.88,31.29
  Bottom 0.152: v40.9,30.27 37.55,30.27 34.42,33.4 33.91,33.4 | v32.31,35.1 32.72,35.1 33.91,33.91 33.91,33.4 | v21.99,48.51 21.39,49.12 21.39,51.27 20.34,52.32 18.21,52.32 17.3,53.24 14.82,53.24 v14.73,53.14 | v21.12,28.9 22.35,28.9 v22.81,29.36 | v20.88,31.29 21.29,30.88 29.97,30.88 32.21,33.12 33.63,33.12 33.91,33.4
PWM_1  (via drill 0.35)
  Top 0.152: U3.1 35.77,27.14 v35.81,27.18 | v41.66,27.18 41.2,27.64 41.2,29.26 42.42,30.48 42.42,32.77 41.2,33.98 41.2,43.11 41.21,43.12 41.21,43.63 | 41.2,43.62 41.21,43.63 | 41.21,43.63 v41.55,43.97 | v40.64,47.44 40.13,47.44 39.79,47.77 39.37,47.77 39.17,47.98 39.17,53.47 42.76,57.06 44.28,57.06 45.17,56.17 MC_1.1 | R15.2 17.71,25.22 v18.03,25.54
  Bottom 0.152: v41.66,27.18 v35.81,27.18 32.01,27.18 31.84,27.35 31.52,27.35 29.21,29.66 24.07,29.66 19.95,25.54 v18.03,25.54 | v41.55,43.97 41.55,44.99 41,45.54 41,47.08 v40.64,47.44
VBUS  (via drill 0.35)
  Top 0.152: IC1.2 IC1.1 13.51,51.51 | IC2.1 IC2.2 37.16,42.16 v34.54,42.16 | 13.51,51.51 13.63,51.63 C5.1 24.06,51.82 v25.4,51.82 26.74,51.82 C4.1 28.45,51.63 30.67,53.85 38.61,53.85 44.68,59.92 MC_1.4 | MC_0.4 7.6,57.42 13.51,51.51 | ABS_1.1 37.28,6.3 35.7,7.88 35.7,10.05 35.83,10.19 37.87,10.19 40.01,12.32 U6.1 40.01,15.62 39.37,16.26 37.08,16.26 36.58,16.76 | ABS_0.1 4.77,6.04 10.13,11.4 14.59,11.4 14.61,11.42 U5.1 15.75,15.04 v16,15.04 | U3.8 37.9,26.92 36.83,26.92 | 36.58,16.76 36.58,21.84 36.79,22.06 | v36.58,34.54 36.58,30.48 36.32,30.23 | 36.32,30.23 34.06,30.23 U4.8 | U2.8 36.79,22.06 | v16.26,16.56 16.56,16.26 36.07,16.26 36.58,16.76 | 36.32,30.23 36.58,29.97 36.58,27.18 36.83,26.92 | 36.83,26.92 36.58,26.67 36.58,22.27 36.79,22.06
  Bottom 0.152: POWER.1 24.77,51.82 | 24.77,51.82 24.77,41.77 25.15,41.4 34.29,41.4 34.54,41.66 | 38.86,38.29 C1.1 | U1.3 41.53,38.41 C1.1 | C1.1 44.38,35.56 VBUS.1 | v34.54,42.16 34.54,41.66 | 24.77,51.82 v25.4,51.82 | v36.58,34.54 38.35,36.32 38.35,37.78 38.86,38.29 | v16,15.04 16,16.3 v16.26,16.56 | 38.86,38.29 38.86,38.35 38.35,38.86 38.35,41.15 38.1,41.4 34.8,41.4 34.54,41.66
VEXC_0  (via drill 0.35)
  Top 0.152: LC_0.1 10.82,46.83 11.81,45.85 IC1.4 17.02,45.85 17.27,46.1 v17.27,47.24 17.27,47.12 IC1.14 | v16.91,52.32 15.24,53.99 15.24,62.74 15.81,63.31 R7.1
  Bottom 0.152: v17.27,47.24 16.76,47.24 16.33,47.68 16.33,51.74 v16.91,52.32
VEXC_1  (via drill 0.35)
  Top 0.152: LC_1.1 44.55,43.08 43.05,44.58 IC2.4 34.67,44.58 v34.54,44.7 34.54,43.34 34.51,43.31 IC2.14 | v34.54,58.42 32.45,58.42 R6.1
  Bottom 0.152: v34.54,44.7 v34.54,58.42
VNEG_0
  Top 0.152: IC1.7 12.57,42.04 10.28,44.33 LC_0.3
VNEG_1
  Top 0.152: LC_1.3 45.47,44.96 43.53,44.96 43.31,45.19 39.32,45.19 38.93,45.57 38.93,47.23 37.77,48.39 IC2.7
VOUT_0  (via drill 0.35)
  Top 0.152: IC1.11 IC1.10 17.65,42.04 v17.53,41.91 | R10.1 10.92,32.58 v10.92,34.04
  Bottom 0.152: v10.92,34.04 12.74,35.85 13.21,35.85 17.53,40.17 v17.53,41.91
VOUT_1  (via drill 0.35)
  Top 0.152: IC2.10 IC2.11 30.61,47.12 30.23,46.74 30.23,40.89 29.97,40.64 v29.72,40.64 | R12.2 9.97,19.56 v9.4,19.56
  Bottom 0.152: v9.4,19.56 8.64,20.32 8.64,30.73 19,41.1 29.52,41.1 29.72,40.89 v29.72,40.64
VPLUS_0
  Top 0.152: IC1.6 11.81,43.31 9.54,45.58 LC_0.2
VPLUS_1
  Top 0.152: LC_1.2 43.73,44.33 43.18,44.88 39.19,44.88 38.63,45.45 38.63,46.74 38.25,47.12 IC2.6
(copper drawn outside any net)
  shapes: Top area x2

### Text on the board
tNames: 100nF | 22kΩ | 15nF | 82kΩ | 39kΩ | 32kΩ | 22kΩ | 3.3V | PE3 | PA6 | PA7
bNames: 100Ω | 560pF